# EAGLE design Top Schematic (EAGLE 9.5.2)
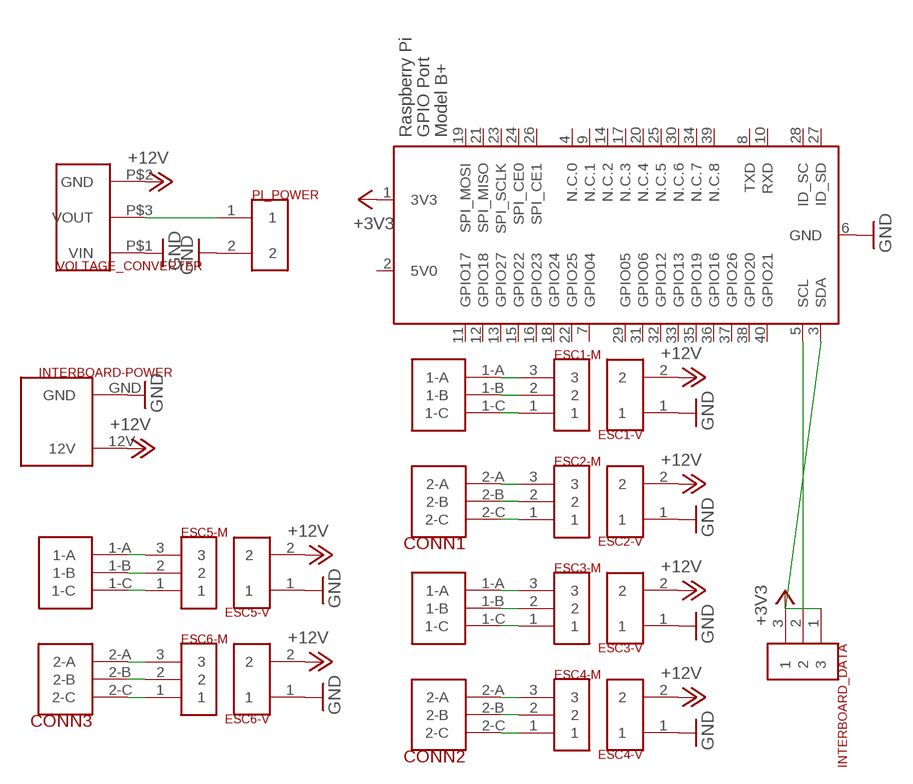
[diagram p0: schematic, sheet 1]

## Parts
CONN1  6CONTACT_ULTRAFIT_R/A  [6CONTACT_ULTRAFIT_R/A]
CONN2  6CONTACT_ULTRAFIT_R/A  [6CONTACT_ULTRAFIT_R/A]
CONN3  6CONTACT_ULTRAFIT_R/A  [6CONTACT_ULTRAFIT_R/A]
ESC1-M  3CONTACT_ULTRAFIT_VERT  [3CONTAC_ULTRAFIT_VERT]
ESC1-V  2CONTACT_ULTRAFIT_VERT  [2CONTAC_ULTRAFIT_VERT]
ESC2-M  3CONTACT_ULTRAFIT_VERT  [3CONTAC_ULTRAFIT_VERT]
ESC2-V  2CONTACT_ULTRAFIT_VERT  [2CONTAC_ULTRAFIT_VERT]
ESC3-M  3CONTACT_ULTRAFIT_VERT  [3CONTAC_ULTRAFIT_VERT]
ESC3-V  2CONTACT_ULTRAFIT_VERT  [2CONTAC_ULTRAFIT_VERT]
ESC4-M  3CONTACT_ULTRAFIT_VERT  [3CONTAC_ULTRAFIT_VERT]
ESC4-V  2CONTACT_ULTRAFIT_VERT  [2CONTAC_ULTRAFIT_VERT]
ESC5-M  3CONTACT_ULTRAFIT_VERT  [3CONTAC_ULTRAFIT_VERT]
ESC5-V  2CONTACT_ULTRAFIT_VERT  [2CONTAC_ULTRAFIT_VERT]
ESC6-M  3CONTACT_ULTRAFIT_VERT  [3CONTAC_ULTRAFIT_VERT]
ESC6-V  2CONTACT_ULTRAFIT_VERT  [2CONTAC_ULTRAFIT_VERT]
INTERBOARD-POWER  2-CONTACT-SUPER  [2-CONTACT-SUPER]
INTERBOARD_DATA  3CONTAC_ULTRAFIT_R/A  [3CONTAC_ULTRAFIT_R/A]
PI_POWER  2CONTACT_ULTRAFIT_R/A  [2CONTAC_ULTRAFIT_R/A]
VOLTAGE_CONVERTER  VOLTAGE_CONVERTER  [VOLTAGE_CONVERTERS]
X1  RASPI_BOARD_B+_F  [RASPI_BOARD_B+_FULL]

## Nets
+3V3 [PWM]: INTERBOARD_DATA.1 X1.1(3V3)
+12V: ESC1-V.2 ESC2-V.2 ESC3-V.2 ESC4-V.2 ESC5-V.2 ESC6-V.2 INTERBOARD-POWER.12V VOLTAGE_CONVERTER.P$2(GND)
GND: ESC1-V.1 ESC2-V.1 ESC3-V.1 ESC4-V.1 ESC5-V.1 ESC6-V.1 INTERBOARD-POWER.GND PI_POWER.2 VOLTAGE_CONVERTER.P$1(VIN) X1.6(GND)
N$1: CONN3.1-A ESC5-M.3
N$2: CONN3.1-B ESC5-M.2
N$3: CONN3.1-C ESC5-M.1
N$4: CONN3.2-A ESC6-M.3
N$5: CONN3.2-B ESC6-M.2
N$6: CONN3.2-C ESC6-M.1
N$7: CONN2.2-C ESC4-M.1
N$8: CONN1.1-B ESC1-M.2
N$9: CONN2.2-B ESC4-M.2
N$10: CONN2.2-A ESC4-M.3
N$11: CONN1.2-B ESC2-M.2
N$12: CONN2.1-C ESC3-M.1
N$13 [PWM]: INTERBOARD_DATA.2 X1.5(SCL)
N$14 [PWM]: INTERBOARD_DATA.3 X1.3(SDA)
N$15: PI_POWER.1 VOLTAGE_CONVERTER.P$3(VOUT)
N$16: CONN2.1-A ESC3-M.3
N$17: CONN2.1-B ESC3-M.2
N$18: CONN1.2-C ESC2-M.1
N$19: CONN1.2-A ESC2-M.3
N$20: CONN1.1-C ESC1-M.1
N$21: CONN1.1-A ESC1-M.3
Unconnected: X1.4(N.C.0) X1.7(GPIO04) X1.8(TXD) X1.9(N.C.1) X1.10(RXD) X1.11(GPIO17) X1.12(GPIO18) X1.13(GPIO27) X1.14(N.C.2) X1.15(GPIO22) X1.16(GPIO23) X1.17(N.C.3) X1.18(GPIO24) X1.19(SPI_MOSI) X1.20(N.C.4) X1.21(SPI_MISO) X1.22(GPIO25) X1.23(SPI_SCLK) X1.24(SPI_CE0) X1.25(N.C.5) X1.26(SPI_CE1) X1.27(ID_SD) X1.28(ID_SC) X1.29(GPIO05) X1.30(N.C.6) X1.31(GPIO06) X1.32(GPIO12) X1.33(GPIO13) X1.34(N.C.7) X1.35(GPIO19) X1.36(GPIO16) X1.37(GPIO26) X1.38(GPIO20) X1.39(N.C.8) X1.40(GPIO21)

## Power pins joined to a net without a drawn wire
5V0: X1.2(5V0)

## Library data of the parts
CONN1-CONN3 = BlueShift:6CONTACT_ULTRAFIT_R/A
ESC1-M ESC2-M ESC3-M ESC4-M ESC5-M ESC6-M = BlueShift:3CONTACT_ULTRAFIT_VERT
ESC1-V ESC2-V ESC3-V ESC4-V ESC5-V ESC6-V = BlueShift:2CONTACT_ULTRAFIT_VERT
INTERBOARD-POWER = BlueShift:2-CONTACT-SUPER
INTERBOARD_DATA = BlueShift:3CONTAC_ULTRAFIT_R/A: Molex 1723161112 12 Position (two Row) Ultra-Fit (14 A) Right Angle Connector Used in 2020 for Underwater Motor to ESC (Through the PCB) Connections Keep in mind you need the Contacts (the bits that get crimped on a wire) the Housing (the bits the contacts get shoved into) and this thing for it to work. Purchase: https://www.digikey.com/product-detail/en/molex/1723161112/WM11853-ND/5360318 Documentation: http://www.literature.molex.com/SQLImages/kelmscott/Molex/PDF_Images/987651-1008.pdf Technical Drawings: https://www.molex.com/pdm_docs/sd/1723161112_sd.pdf All Molex Connectors on Digikey: https://www.digikey.com/en/product-highlight/m/molex/power-connectors
PI_POWER = BlueShift:2CONTACT_ULTRAFIT_R/A
VOLTAGE_CONVERTER = BlueShift:VOLTAGE_CONVERTER
X1 = raspberrypi_bastelstube_v13:RASPI_BOARD_B+: Raspberry Pi GPIO connector with markings for the outer dimensions of the Raspberry Pi board model B+ with different sets of drill holes or mounting pads

## Net classes
1 PWM: width 0.254 mm
2 ESC: width 1.016 mm

## Board
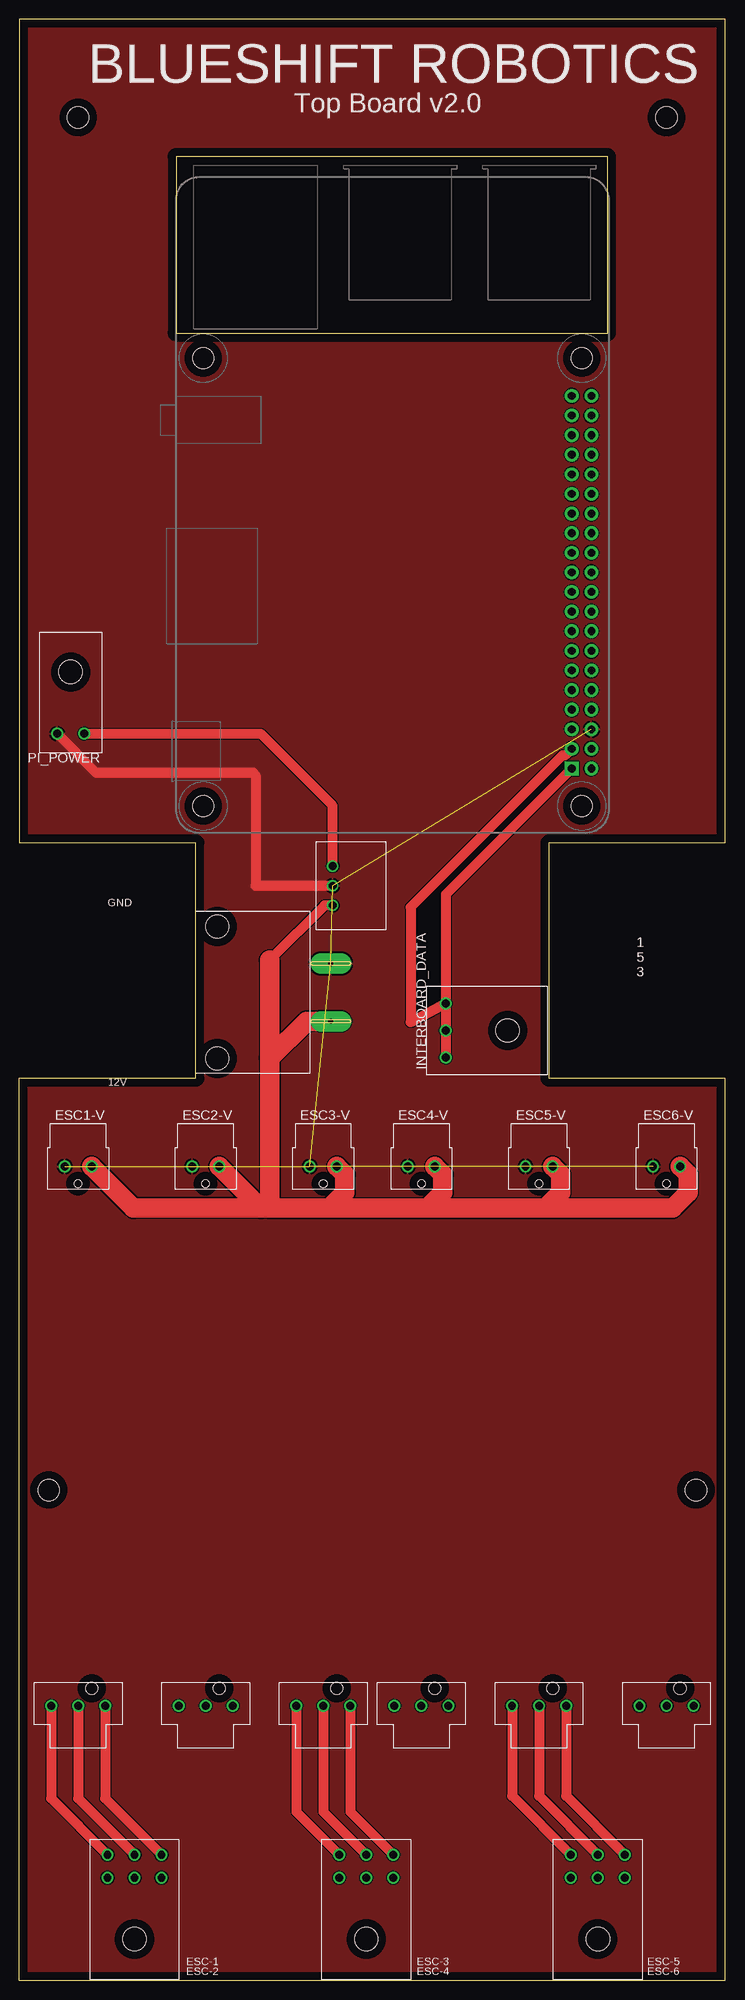
[diagram p1: board, top side]
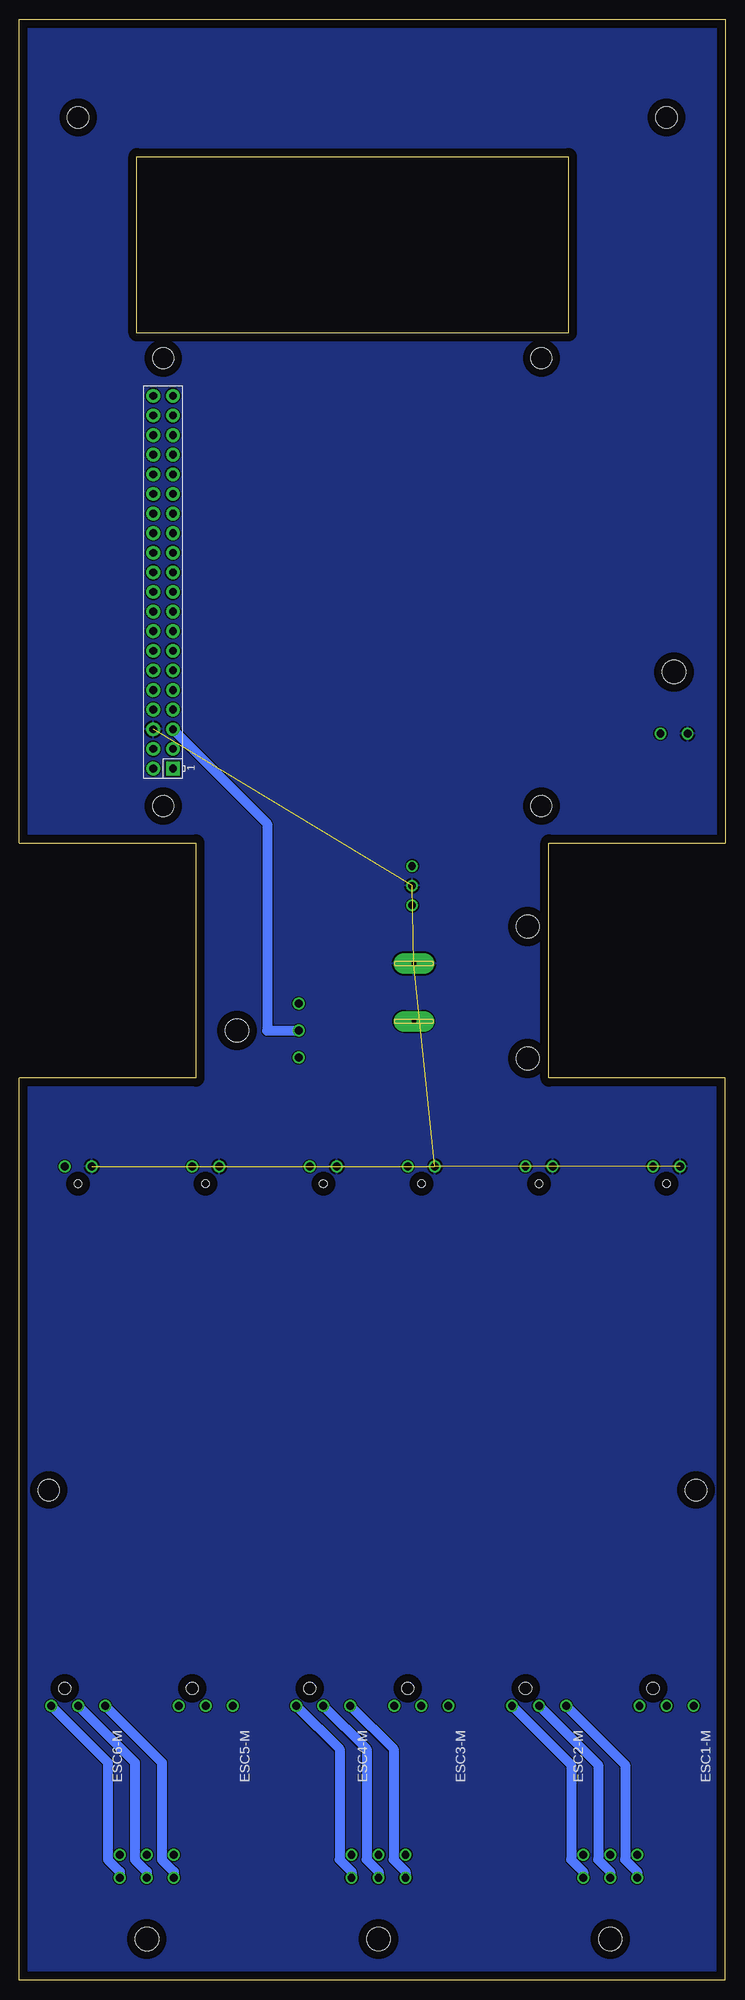
[diagram p2: board, bottom side, seen from below]

Size 91.44 x 254 mm. Coordinates in mm from the lower left corner, seen from the top.
Outline: 91.44,147.32 68.58,147.32 68.58,116.84 91.44,116.84 91.44,0 0,0 0,116.84 22.86,116.84 22.86,147.32 0,147.32 0,254 91.44,254 91.44,147.32
Outline: 20.32,236.22 20.32,213.36 76.2,213.36 76.2,236.22 20.32,236.22
Copper layers (1*16): Top 0.035mm / dielectric 1.5mm / Bottom 0.035mm
Design rules "default *": minimum track width 6mil, minimum drill 0.35mm, track to track 6mil, track to pad 6mil, pad to pad 6mil, via to via 6mil, smd to smd 6mil, copper to edge 40mil, drill to drill 6mil, minimum pad ring 10mil, minimum via ring 8mil, stop-mask expansion 4mil, vias tented up to drill 0mil, thermal gap 10mil
Holes 2.79 mm at 3.81,63.5 87.63,63.5 83.82,241.3 7.62,241.3

### Footprints (pad centres in the part's own frame; a part is rotated, then mirrored left to right if it is on the bottom)
6CONTACT_ULTRAFIT_R/A = drill 1.02: 1-A -3.5,0; 1-B 0,0; 1-C 3.5,0; 2-A -3.5,-3; 2-B 0,-3; 2-C 3.5,-3 | hole 3.05: 0,-10.91
3CONTAC_ULTRAFIT_VERT = drill 1.02: 1 -3.5,0; 2 0,0; 3 3.5,0 | hole 1.6: -1.75,-2.23
2CONTAC_ULTRAFIT_VERT = drill 1.02: 1 -1.75,0; 2 1.75,0 | hole 1.02: 0,-2.23
2-CONTACT-SUPER = drill 0.6 pad 2.65 long: 12V -12.29,-14.715; GND -4.8,-14.715 | hole 3: 0,0; -17.09,0
3CONTAC_ULTRAFIT_R/A = drill 1.02: 1 -3.5,-2.5; 2 0,-2.5; 3 3.5,-2.5 | hole 3.05: 0,-10.5
2CONTAC_ULTRAFIT_R/A = drill 1.02: 1 -1.75,-2.5; 2 1.75,-2.5 | hole 3.05: 0,-10.5
VOLTAGE_CONVERTERS = drill 1: P$1 0,2.35; P$2 -2.54,2.35; P$3 2.54,2.35
RASPI_BOARD_B+_FULL = drill 1 pad 1.778 square: 1 8.37,51.23 | drill 1 pad 1.778: 2 8.37,53.77; 3 10.91,51.23; 4 10.91,53.77; 5 13.45,51.23; 6 13.45,53.77; 7 15.99,51.23; 8 15.99,53.77; 9 18.53,51.23; 10 18.53,53.77; 11 21.07,51.23; 12 21.07,53.77; 13 23.61,51.23; 14 23.61,53.77; 15 26.15,51.23; 16 26.15,53.77; 17 28.69,51.23; 18 28.69,53.77; 19 31.23,51.23; 20 31.23,53.77; 21 33.77,51.23; 22 33.77,53.77; 23 36.31,51.23; 24 36.31,53.77; 25 38.85,51.23; 26 38.85,53.77; 27 41.39,51.23; 28 41.39,53.77; 29 43.93,51.23; 30 43.93,53.77; 31 46.47,51.23; 32 46.47,53.77; 33 49.01,51.23; 34 49.01,53.77; 35 51.55,51.23; 36 51.55,53.77; 37 54.09,51.23; 38 54.09,53.77; 39 56.63,51.23; 40 56.63,53.77 | hole 2.75: 3.5,3.5; 3.5,52.5; 61.5,3.5; 61.5,52.5

### Placement (x,y rotation side)
CONN1  14.92,16.25 0 top
CONN2  44.92,16.25 0 top
CONN3  74.92,16.25 0 top
ESC1-M  7.62,35.56 180 top
ESC1-V  7.62,105.41 0 top
ESC2-M  24.13,35.56 180 top
ESC2-V  24.13,105.41 0 top
ESC3-M  39.37,35.56 180 top
ESC3-V  39.37,105.41 0 top
ESC4-M  52.07,35.56 180 top
ESC4-V  52.07,105.41 0 top
ESC5-M  67.31,35.56 180 top
ESC5-V  67.31,105.41 0 top
ESC6-M  83.82,35.56 180 top
ESC6-V  83.82,105.41 0 top
INTERBOARD-POWER  25.62,136.5 90 top
INTERBOARD_DATA  52.74,123.01 90 top
PI_POWER  6.65,158.96 180 top
VOLTAGE_CONVERTER  42.93,141.77 90 top
X1  20.32,148.59 90 bottom

### Tracks (layer width: path | path; a pad name or v marks a point on that pad's centre or on a via)
+3V3
  Top 1.27: X1.1 55.24,140.65 INTERBOARD_DATA.1
+12V
  Top 1.27: VOLTAGE_CONVERTER.P$2 39.52,139.23 32.42,132.12
  Top 2.54: 9.42,105.36 ESC1-V.2 14.78,100 31.29,100 | INTERBOARD-POWER.12V 37.2,124.21 32.42,119.42 | 32.42,132.12 32.42,119.42 | 32.42,119.42 32.42,100 | 32.42,100 31.29,100 | ESC2-V.2 31.29,100 | ESC3-V.2 41.12,105.38 42.17,104.34 42.17,102.02 40.14,100 | 32.42,100 40.14,100 | ESC4-V.2 53.82,105.38 54.87,104.34 54.87,102.02 52.84,100 | 40.14,100 52.84,100 | ESC5-V.2 69.06,105.38 70.11,104.34 70.11,102.02 68.08,100 | 52.84,100 68.08,100 | ESC6-V.2 85.57,105.38 86.62,104.34 86.62,102.02 84.59,100 68.08,100
GND  (8 unrouted)
  Top 1.27: VOLTAGE_CONVERTER.P$1 30.62,141.77 30.62,156.06 30.3,156.38 9.98,156.38 PI_POWER.2
  pour Top: -16.51,261.62 -16.51,-8.89 -15.24,-10.16 107.95,-10.16 107.95,262.89 -15.24,262.89
  pour Bottom: -16.51,261.62 -16.51,-10.16 107.95,-10.16 109.22,-8.89 109.22,262.89 107.95,264.16 -13.97,264.16
N$1
  Top 1.27: ESC5-M.3 63.81,23.86 CONN3.1-A
N$2
  Top 1.27: ESC5-M.2 67.31,23.86 CONN3.1-B
N$3
  Top 1.27: ESC5-M.1 70.81,23.86 CONN3.1-C
N$4
  Bottom 1.27: CONN3.2-A 71.42,14.05 72.97,15.61 72.97,28.21 ESC6-M.3
N$5
  Bottom 1.27: CONN3.2-B 74.92,14.05 76.47,15.61 76.47,28.21 ESC6-M.2
N$6
  Bottom 1.27: CONN3.2-C 78.42,14.05 79.97,15.61 79.97,28.21 ESC6-M.1
N$7
  Bottom 1.27: CONN2.2-C 48.42,14.05 49.97,15.61 49.97,29.96 ESC4-M.1
N$8
  Top 1.27: ESC1-M.2 7.62,23.55 CONN1.1-B
N$9
  Bottom 1.27: CONN2.2-B 44.92,14.05 46.47,15.61 46.47,29.96 ESC4-M.2
N$10
  Bottom 1.27: CONN2.2-A 41.42,14.05 42.97,15.61 42.97,29.96 ESC4-M.3
N$11
  Bottom 1.27: CONN1.2-B 14.92,14.05 16.47,15.61 16.47,27.9 ESC2-M.2
N$12
  Top 1.27: ESC3-M.1 42.87,21.8 CONN2.1-C
N$13
  Bottom 1.27: INTERBOARD_DATA.2 59.33,123.01 59.33,149.82 X1.5
N$14
  Top 1.27: X1.3 70.69,158.64 70.34,158.64 50.68,138.98 50.68,124.07 INTERBOARD_DATA.3
N$15
  Top 1.27: VOLTAGE_CONVERTER.P$3 40.58,152.14 31.26,161.46 PI_POWER.1
N$16
  Top 1.27: ESC3-M.3 35.87,21.8 CONN2.1-A
N$17
  Top 1.27: ESC3-M.2 39.37,21.8 CONN2.1-B
N$18
  Bottom 1.27: CONN1.2-C 18.42,14.05 19.97,15.61 19.97,27.9 ESC2-M.1
N$19
  Bottom 1.27: CONN1.2-A 11.42,14.05 12.97,15.61 12.97,27.9 ESC2-M.3
N$20
  Top 1.27: ESC1-M.1 11.12,23.55 CONN1.1-C
N$21
  Top 1.27: ESC1-M.3 4.12,23.55 CONN1.1-A

### Text on the board
tNames: BLUESHIFT ROBOTICS | Top Board v2.0 | GND | GND | 1 / 5 / 3 | 12V | ESC-1 | ESC-3 | ESC-5 | ESC-2 | ESC-4 | ESC-6